# EAGLE design multi-pcb-analog-with-cc (EAGLE 9.6.2)
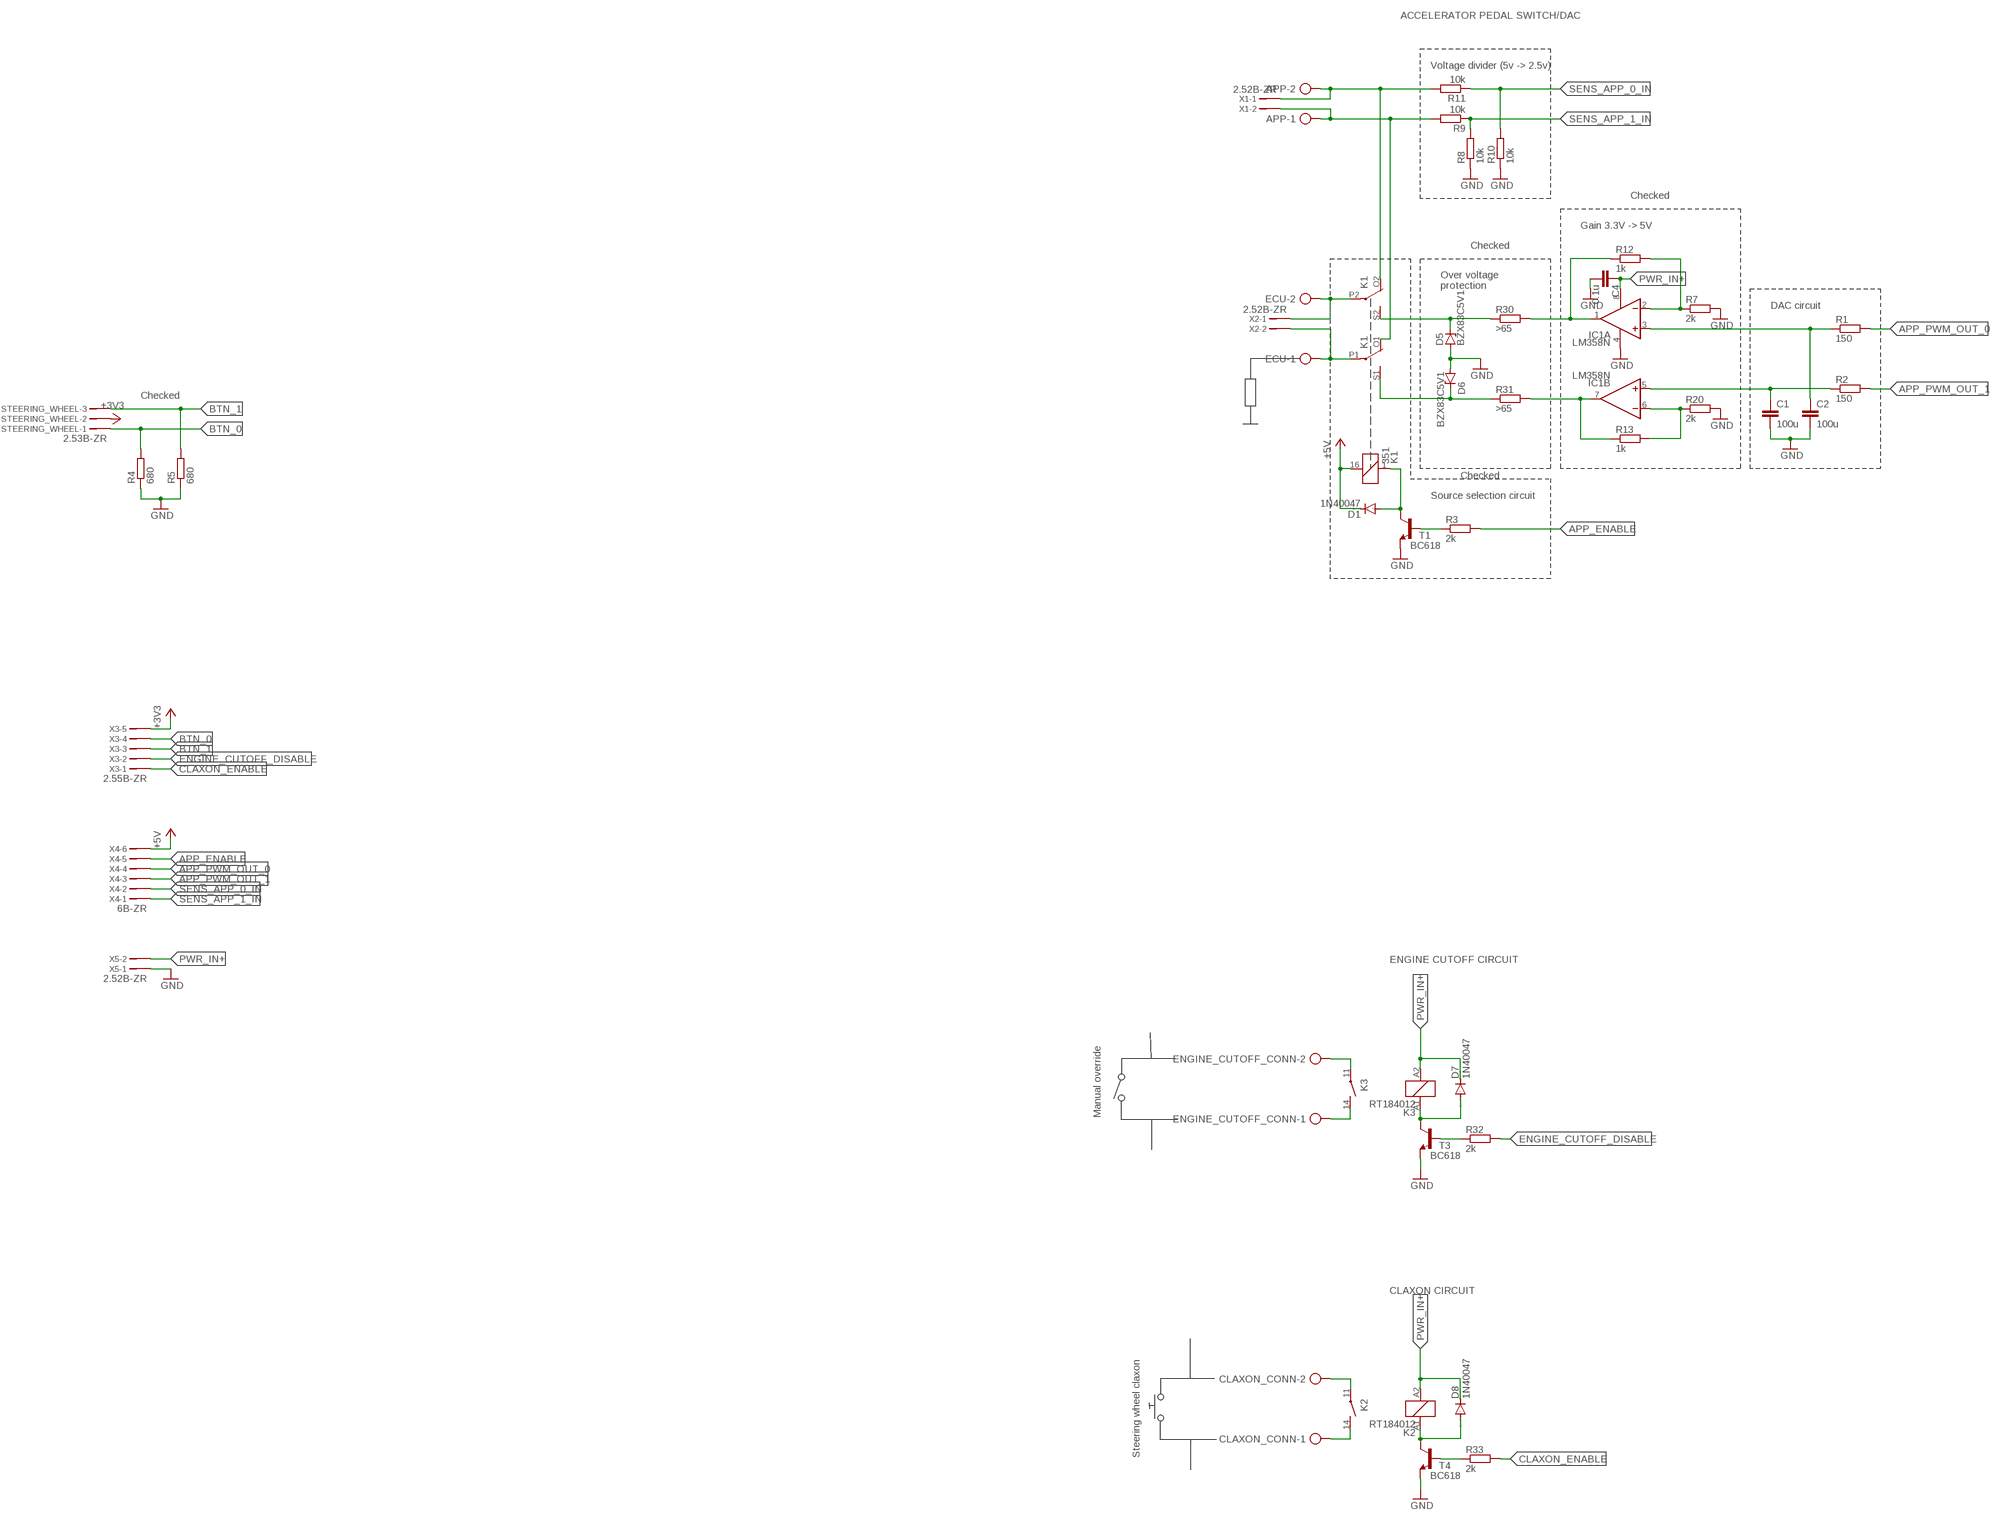
[diagram p0: schematic, sheet 1]

## Parts
APP  AK300/2  [AK300/2]
C1  100u  C-EU025-050X050  [C025-050X050]
C2  100u  C-EU025-050X050  [C025-050X050]
C4  0.1u  C-EU025-050X050  [C025-050X050]
CLAXON_CONN  AK300/2  [AK300/2]
D1  1N40047  [DO41-7.6]
D5  BZX83C5V1  BZX857  [DO41Z7.6]
D6  BZX83C5V1  BZX857  [DO41Z7.6]
D7  1N40047  [DO41-7.6]
D8  1N40047  [DO41-7.6]
ECU  AK300/2  [AK300/2]
ENGINE_CUTOFF_CONN  AK300/2  [AK300/2]
IC1  LM358N  [DIL08]
K1  351  [351]
K2  RT184012  [RT-N/O12A3.5]
K3  RT184012  [RT-N/O12A3.5]
R1  150  R-EU_0207/7  [0207/7]
R2  150  R-EU_0207/7  [0207/7]
R3  2k  R-EU_0207/7  [0207/7]
R4  680  R-EU_0207/7  [0207/7]
R5  680  R-EU_0207/7  [0207/7]
R7  2k  R-EU_0207/7  [0207/7]
R8  10k  R-EU_0207/7  [0207/7]
R9  10k  R-EU_0207/7  [0207/7]
R10  10k  R-EU_0207/7  [0207/7]
R11  10k  R-EU_0207/7  [0207/7]
R12  1k  R-EU_0207/7  [0207/7]
R13  1k  R-EU_0207/7  [0207/7]
R20  2k  R-EU_0207/7  [0207/7]
R30  >65  R-EU_0207/7  [0207/7]
R31  >65  R-EU_0207/7  [0207/7]
R32  2k  R-EU_0207/7  [0207/7]
R33  2k  R-EU_0207/7  [0207/7]
STEERING_WHEEL  2.53B-ZR  [B3B-ZR2.5]
T1  BC618  [TO92-EBC]
T3  BC618  [TO92-EBC]
T4  BC618  [TO92-EBC]
X1  2.52B-ZR  [B2B-ZR2.5]
X2  2.52B-ZR  [B2B-ZR2.5]
X3  2.55B-ZR  [B5B-ZR2.5]
X4  6B-ZR  [B6B-ZR2.5]
X5  2.52B-ZR  [B2B-ZR2.5]

## Nets
+3V3: STEERING_WHEEL.2 X3.5
+5V: D1.C K1.16 X4.6
APP_0_IN: APP.2 K1.O2(3:O) R11.2 X1.1
APP_1_IN: APP.1 K1.O1(2:O) R9.2 X1.2
APP_ENABLE: R3.2 X4.5
APP_PWM_OUT_0: R1.2 X4.4
APP_PWM_OUT_1: R2.2 X4.3
BTN_0: R4.2 STEERING_WHEEL.1 X3.4
BTN_1: R5.2 STEERING_WHEEL.3 X3.3
CLAXON_ENABLE: R33.2 X3.1
ENGINE_CUTOFF_DISABLE: R32.2 X3.2
GND: C1.2 C2.2 C4.2 D5.A D6.A IC1.4(P:V-) R4.1 R5.1 R7.2 R8.1 R10.1 R20.2 T1.E T3.E T4.E X5.1
N$1: D1.A K1.1 T1.C
N$2: R3.1 T1.B
N$3: D6.C K1.S1(2:S) R31.1
N$4: IC1.1(A:OUT) R12.1 R30.2
N$6: ECU.2 K1.P2(3:P) X2.1
N$7: ECU.1 K1.P1(2:P) X2.2
N$8: C2.1 IC1.3(A:+IN) R1.1
N$9: C1.1 IC1.5(B:+IN) R2.1
N$13: IC1.2(A:-IN) R7.1 R12.2
N$16: IC1.6(B:-IN) R13.2 R20.1
N$17: D5.C K1.S2(3:S) R30.1
N$18: IC1.7(B:OUT) R13.1 R31.2
N$19: ENGINE_CUTOFF_CONN.2 K3.11(2:P)
N$20: ENGINE_CUTOFF_CONN.1 K3.14(2:S)
N$22: D7.A K3.A1 T3.C
N$23: D8.A K2.A1 T4.C
N$25: R33.1 T4.B
N$26: R32.1 T3.B
N$27: CLAXON_CONN.2 K2.11(2:P)
N$28: CLAXON_CONN.1 K2.14(2:S)
PWR_IN+: C4.1 D7.C D8.C IC1.8(P:V+) K2.A2 K3.A2 X5.2
SENS_APP_0_IN: R10.2 R11.1 X4.2
SENS_APP_1_IN: R8.2 R9.1 X4.1

## Notes on the sheet
- ACCELERATOR PEDAL SWITCH/DAC
- Voltage divider (5v -> 2.5v)
- Checked
- Gain 3.3V -> 5V
- Checked
- Over voltage
  protection
- DAC circuit
- Checked
- Checked
- Source selection circuit
- ENGINE CUTOFF CIRCUIT
- Manual override
- CLAXON CIRCUIT
- Steering wheel claxon

## Library data of the parts
APP CLAXON_CONN ECU ENGINE_CUTOFF_CONN = con-ptr500-custom:AK300/2: CONNECTOR; OC_FARNELL: unknown; OC_NEWARK: unknown
C1 C2 C4 = rcl:C-EU: CAPACITOR, European symbol; SPICEPREFIX: C
D1 D7 D8 = diode-custom:1N4004: DIODE general purpose rectifier, 1 A
D5 D6 = diode-custom:BZX85: Z DIODE
IC1 = linear:LM358: OP AMP also LM158; LM258; LM2904 Source: http://cache.national.com/ds/LM/LM158.pdf
K1 = relay:351: RELAY 2 x switch, Omron; OC_FARNELL: unknown; OC_NEWARK: unknown
K2 K3 = relay:RT?*: Power PCB Relay SCHRACK 1 pole 12 / 16 A, DC- or AC-coil Source: http://www.schrack.com/.. 5819.pdf; MF: TYCO ELECTRONICS; MPN: RT184012; OC_FARNELL: unknown; OC_NEWARK: 08H3731
R1-R5 R7-R13 R20 R30-R33 = rcl:R-EU_: RESISTOR, European symbol; SPICEPREFIX: R
STEERING_WHEEL = con-jst-custom:?3B-ZR: ZH CONNECTOR 1.5 mm, 4 pin 1 row Source: http://www.jst.com .. eZH.pdf
T1 T3 T4 = transistor-npn:BC618*: NPN Transistor
X1 X2 X5 = con-jst-custom:?2B-ZR: ZH CONNECTOR 1.5 mm, 4 pin 1 row Source: http://www.jst.com .. eZH.pdf
X3 = con-jst-custom:?5B-ZR: ZH CONNECTOR 1.5 mm, 4 pin 1 row Source: http://www.jst.com .. eZH.pdf
X4 = con-jst-custom:?6B-ZR: ZH CONNECTOR 1.5 mm, 4 pin 1 row Source: http://www.jst.com .. eZH.pdf

## Board
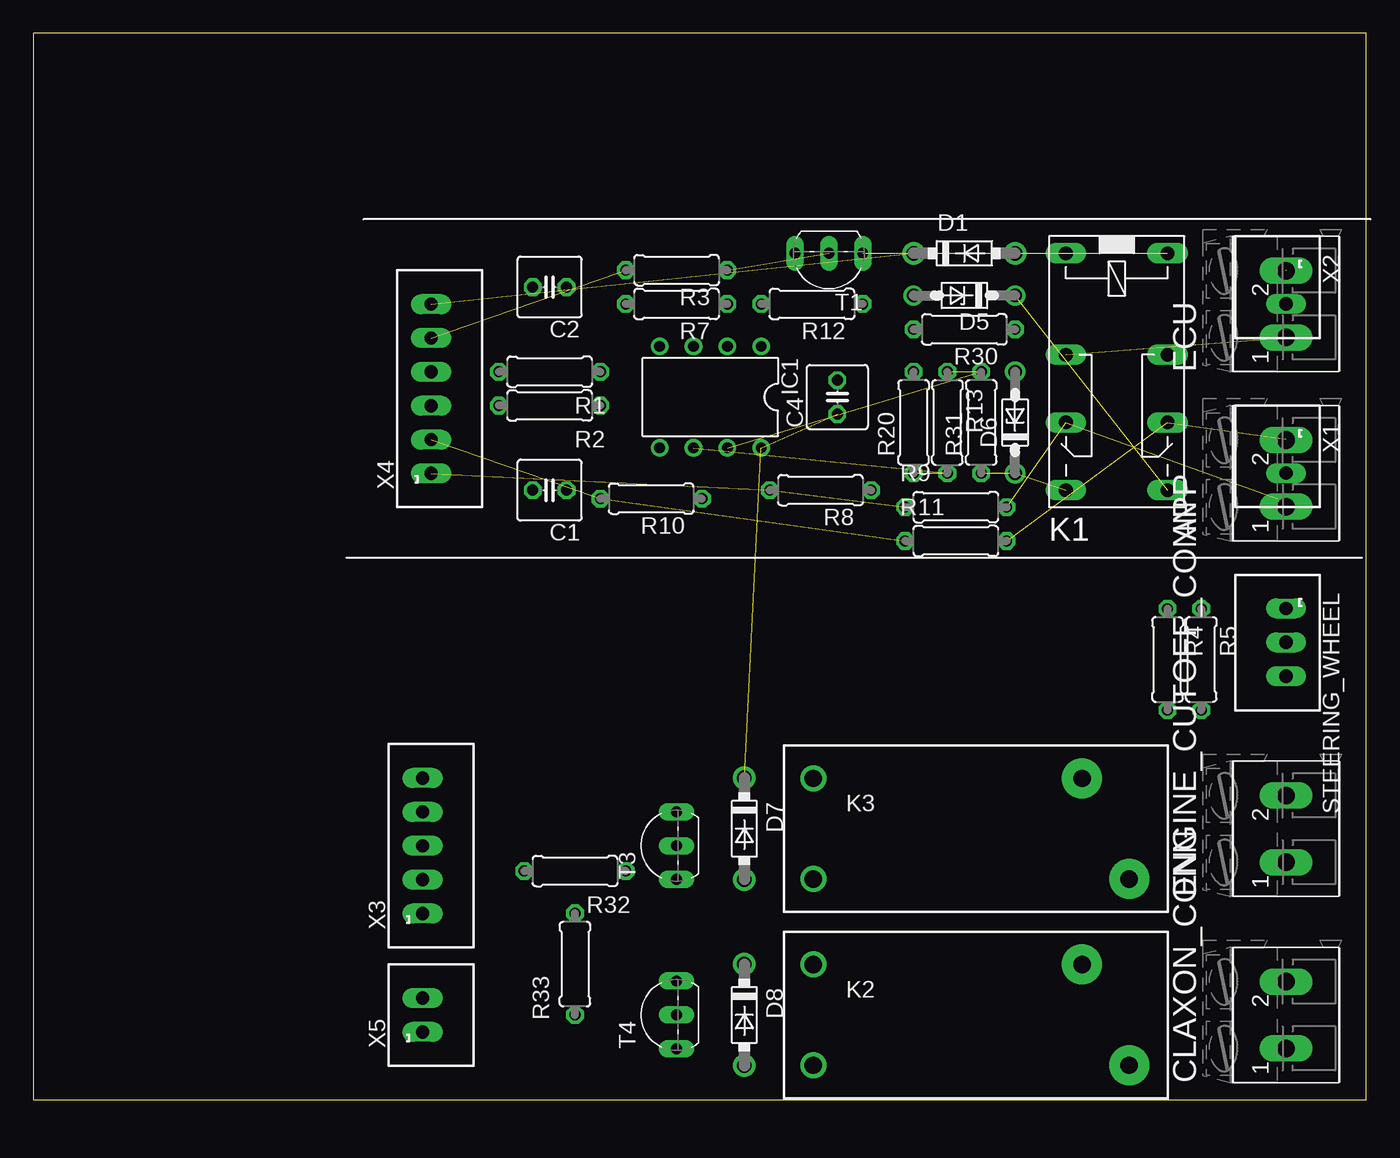
[diagram p1: board, top side]
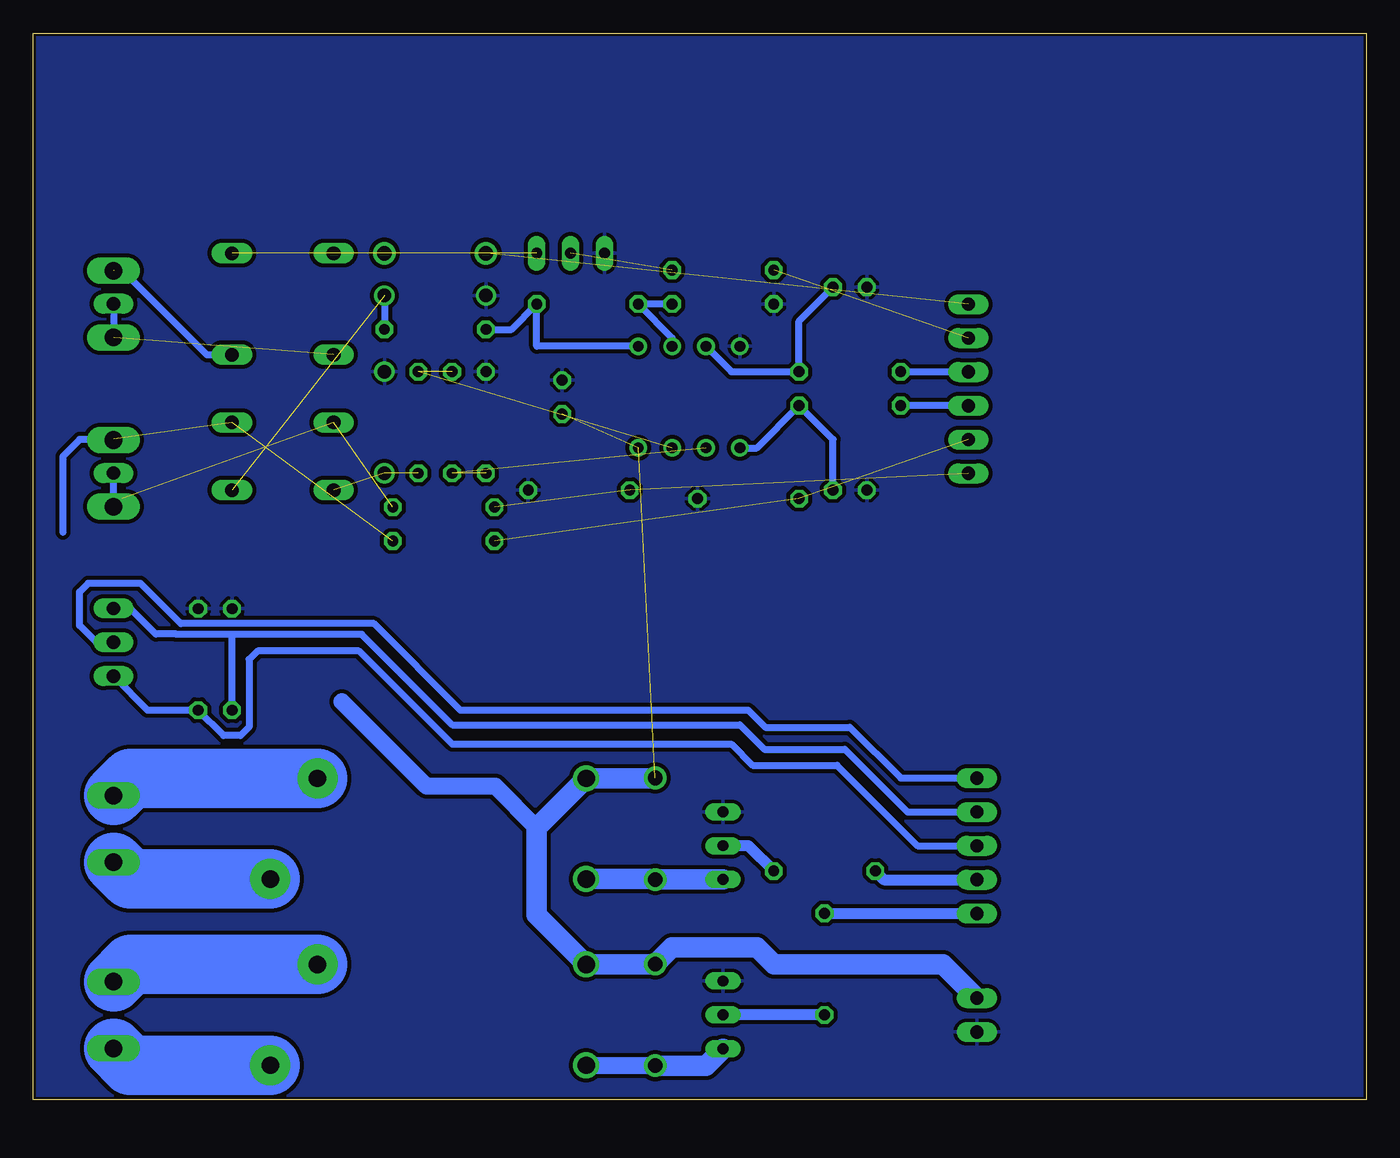
[diagram p2: board, bottom side, seen from below]

Size 100 x 80 mm. Coordinates in mm from the lower left corner, seen from the top.
Outline: 0,0 100,0 100,80 0,80 0,0
Copper layers (1*16): Top 0.035mm / dielectric 1.5mm / Bottom 0.035mm
Design rules "home-made-pcb": minimum track width 8mil, minimum drill 0.3mm, track to track 12mil, track to pad 8mil, pad to pad 10mil, via to via 10mil, smd to smd 6mil, copper to edge 8mil, drill to drill 10mil, minimum pad ring 10mil, minimum via ring 20mil, stop-mask expansion 4mil, vias tented up to drill 0mil, thermal gap 10mil

### Footprints (pad centres in the part's own frame; a part is rotated, then mirrored left to right if it is on the bottom)
AK300/2 = drill 1.321 long: 1 -2.515,0; 2 2.489,0
C025-050X050 = drill 0.813 octagon: 1 -1.27,0; 2 1.27,0
DO41-7.6 = drill 1.1 pad 1.7: A 3.81,0; C -3.81,0
DO41Z7.6 = drill 1: A 3.81,0; C -3.81,0
DIL08 = drill 0.813 pad 1.27: 1 -3.81,-3.81; 2 -1.27,-3.81; 3 1.27,-3.81; 4 3.81,-3.81; 5 3.81,3.81; 6 1.27,3.81; 7 -1.27,3.81; 8 -3.81,3.81
351 = drill 1.016 long: 1 -3.81,-3.81; 16 -3.81,3.81; O1 8.89,-3.81; O2 8.89,3.81; P1 3.81,-3.81; P2 3.81,3.81; S1 13.97,-3.81; S2 13.97,3.81
RT-N/O12A3.5 = drill 1.3 pad 3: 11 7.56,3.78; 14 11.1,-3.78 | drill 1.3: A1 -12.6,-3.78; A2 -12.6,3.78
0207/7 = drill 0.813 octagon: 1 -3.81,0; 2 3.81,0
B3B-ZR2.5 = drill 1 pad 1.422 long: 1 -2.555,0; 2 -0.013,0; 3 2.527,0
TO92-EBC = drill 0.813 long: B 0,-1.27; C -2.54,-1.27; E 2.54,-1.27
B2B-ZR2.5 = drill 1 pad 1.422 long: 1 -1.285,0; 2 1.257,0
B5B-ZR2.5 = drill 1 pad 1.422 long: 1 -5.095,0; 2 -2.553,0; 3 -0.013,0; 4 2.527,0; 5 5.067,0
B6B-ZR2.5 = drill 1 pad 1.422 long: 1 -6.365,0; 2 -3.823,0; 3 -1.283,0; 4 1.257,0; 5 3.797,0; 6 6.337,0

### Placement (x,y rotation side)
APP  93.98,46.99 90 top
C1  38.73,45.72 180 top
C2  38.73,60.96 180 top
C4  60.33,52.7 90 top
CLAXON_CONN  93.98,6.35 90 top
D1  69.85,63.5 0 top
D5  69.85,60.33 180 top
D6  73.66,50.8 90 top
D7  53.34,20.32 270 top
D8  53.34,6.35 270 top
ECU  93.98,59.69 90 top
ENGINE_CUTOFF_CONN  93.98,20.32 90 top
IC1  50.8,52.7 180 top
K1  81.28,59.69 270 top
K2  71.12,6.35 0 top
K3  71.12,20.32 0 top
R1  38.73,54.61 180 top
R2  38.73,52.07 180 top
R3  48.26,62.23 180 top
R4  85.09,33.02 270 top
R5  87.63,33.02 270 top
R7  48.26,59.69 180 top
R8  59.05,45.72 180 top
R9  69.22,44.45 0 top
R10  46.35,45.09 180 top
R11  69.22,41.91 0 top
R12  58.42,59.69 180 top
R13  68.58,50.8 270 top
R20  66.04,50.8 90 top
R30  69.85,57.78 180 top
R31  71.12,50.8 90 top
R32  40.64,17.14 180 top
R33  40.64,10.16 90 top
STEERING_WHEEL  93.98,34.29 270 top
T1  59.69,62.23 180 top
T3  46.99,19.05 90 top
T4  46.99,6.35 90 top
X1  93.98,48.26 270 top
X2  93.98,60.96 270 top
X3  29.21,19.05 90 top
X4  29.84,53.34 90 top
X5  29.21,6.35 90 top

### Tracks (layer width: path | path; a pad name or v marks a point on that pad's centre or on a via)
+3V3
  Bottom 0.508: STEERING_WHEEL.2 93.99,34.29 95.25,34.29 96.52,35.56 96.52,38.1 95.89,38.73 91.95,38.73 88.93,35.71 74.45,35.71 67.94,29.21 46.35,29.21 45.08,27.93 38.74,27.93 34.92,24.12 X3.5
+5V  (2 unrouted)
APP_0_IN  (2 unrouted)
  Bottom 0.508: 94.05,49.48 APP.2 | 94.05,49.48 X1.1 94,49.53 96.52,49.53 97.79,48.26 97.79,42.55 | 94.05,49.48 95.3,49.48
APP_1_IN  (2 unrouted)
  Bottom 0.508: APP.1 X1.2 | APP.1 93.34,45.11 | APP.1 93.98,43.81
APP_ENABLE  (1 unrouted)
APP_PWM_OUT_0
  Bottom 0.508: R1.2 34.91,54.6 X4.4
APP_PWM_OUT_1
  Bottom 0.508: R2.2 34.91,52.06 X4.3
BTN_0
  Bottom 0.508: STEERING_WHEEL.1 92.72,36.84 90.81,34.92 89.29,34.92 89.27,34.9 85.09,34.9 | X3.4 34.41,21.58 39.12,26.29 45.16,26.29 46.99,28.12 68.58,28.12 75.36,34.9 85.09,34.9 | R4.2 85.09,34.9
BTN_1
  Bottom 0.508: STEERING_WHEEL.3 91.43,29.21 R5.2 85.72,27.3 84.45,27.3 83.82,27.94 83.82,33.02 83.19,33.66 75.56,33.66 68.58,26.67 47.62,26.67 46.03,25.08 39.69,25.08 33.66,19.04 X3.3
CLAXON_ENABLE
  Bottom 0.813: R33.2 40.62,13.96 X3.1
ENGINE_CUTOFF_DISABLE
  Bottom 0.813: R32.2 36.18,16.5 X3.2
GND
  pour Bottom: 0,80.01 0,0 100.33,0 100.33,80.01
N$1  (2 unrouted)
N$2  (1 unrouted)
N$3  (2 unrouted)
N$4
  Bottom 0.508: R30.2 64.14,57.78 R12.1 62.23,56.52 IC1.1
N$6  (1 unrouted)
  Bottom 0.508: X2.1 93.34,62.24 86.98,55.88 K1.P2
N$7  (1 unrouted)
  Bottom 0.508: X2.2 ECU.1
N$8
  Bottom 0.508: C2.1 42.55,58.42 R1.1 47.62,54.61 IC1.3
N$9
  Bottom 0.508: IC1.5 45.72,48.9 R2.1 40.01,49.53 C1.1
N$13
  Bottom 0.508: R7.1 R12.2 52.07,57.15 IC1.2
N$16  (2 unrouted)
N$17  (1 unrouted)
  Bottom 0.508: D5.C R30.1
N$18  (2 unrouted)
N$19
  Bottom 4.445: K3.11 92.69,24.1 ENGINE_CUTOFF_CONN.2
N$20
  Bottom 4.445: K3.14 92.72,16.54 ENGINE_CUTOFF_CONN.1
N$22
  Bottom 1.524: K3.A1 53.37,16.54 D7.A T3.C
N$23
  Bottom 1.27: D8.A 58.49,2.54 K2.A1
  Bottom 1.524: D8.A 49.53,2.54 T4.C
N$25
  Bottom 0.813: R33.1 T4.B
N$26
  Bottom 0.813: T3.B 46.35,19.05 R32.1
N$27
  Bottom 4.445: K2.11 92.69,10.13 CLAXON_CONN.2
N$28
  Bottom 4.445: K2.14 92.72,2.57 CLAXON_CONN.1
PWR_IN+  (2 unrouted)
  Bottom 1.27: 58.49,10.16 K2.A2 | 62.23,20.39 65.33,23.5 70.48,23.5 76.83,29.84
  Bottom 1.524: X5.2 31.76,10.16 44.45,10.16 45.72,11.43 52.07,11.43 D8.C 58.49,10.16 | K2.A2 62.23,13.84 62.23,20.39 K3.A2 53.37,24.1 D7.C
SENS_APP_0_IN  (2 unrouted)
SENS_APP_1_IN  (2 unrouted)